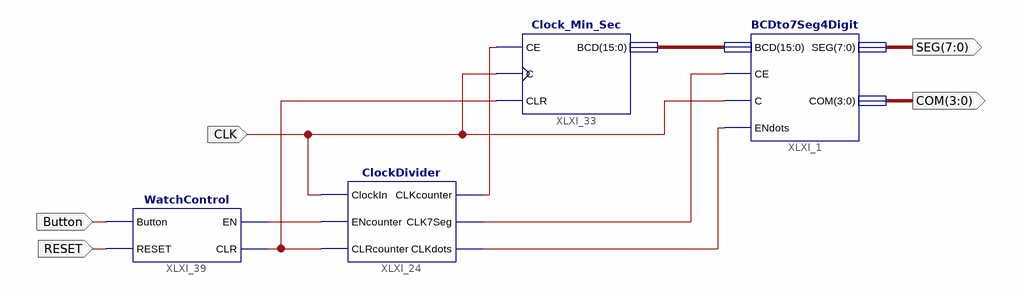
[diagram p0: schematic sheet 1]
// Xilinx ISE schematic StopWatch.sch (spartan6) as structural Verilog: 4 symbols, 5 ports
module StopWatch (
  input  CLK,
  input  RESET,
  input  Button,
  output [7:0] SEG,
  output [3:0] COM
);

  wire XLXN_230, XLXN_232, XLXN_241, XLXN_297, XLXN_299;
  wire [15:0] XLXN_223;

  BCDto7Seg4Digit XLXI_1 (.BCD(XLXN_223), .C(CLK), .CE(XLXN_232), .COM(COM), .SEG(SEG), .ENdots(XLXN_241));
  Clock_Min_Sec XLXI_33 (.BCD(XLXN_223), .CLR(XLXN_297), .CE(XLXN_230), .C(CLK));
  ClockDivider XLXI_24 (
    .ClockIn(CLK), .ENcounter(XLXN_299), .CLK7Seg(XLXN_232), .CLKcounter(XLXN_230), .CLKdots(XLXN_241),
    .CLRcounter(XLXN_297));
  WatchControl XLXI_39 (.EN(XLXN_299), .CLR(XLXN_297), .RESET(RESET), .Button(Button));
endmodule
